# EAGLE design kbdctrl (EAGLE 7.5.0)
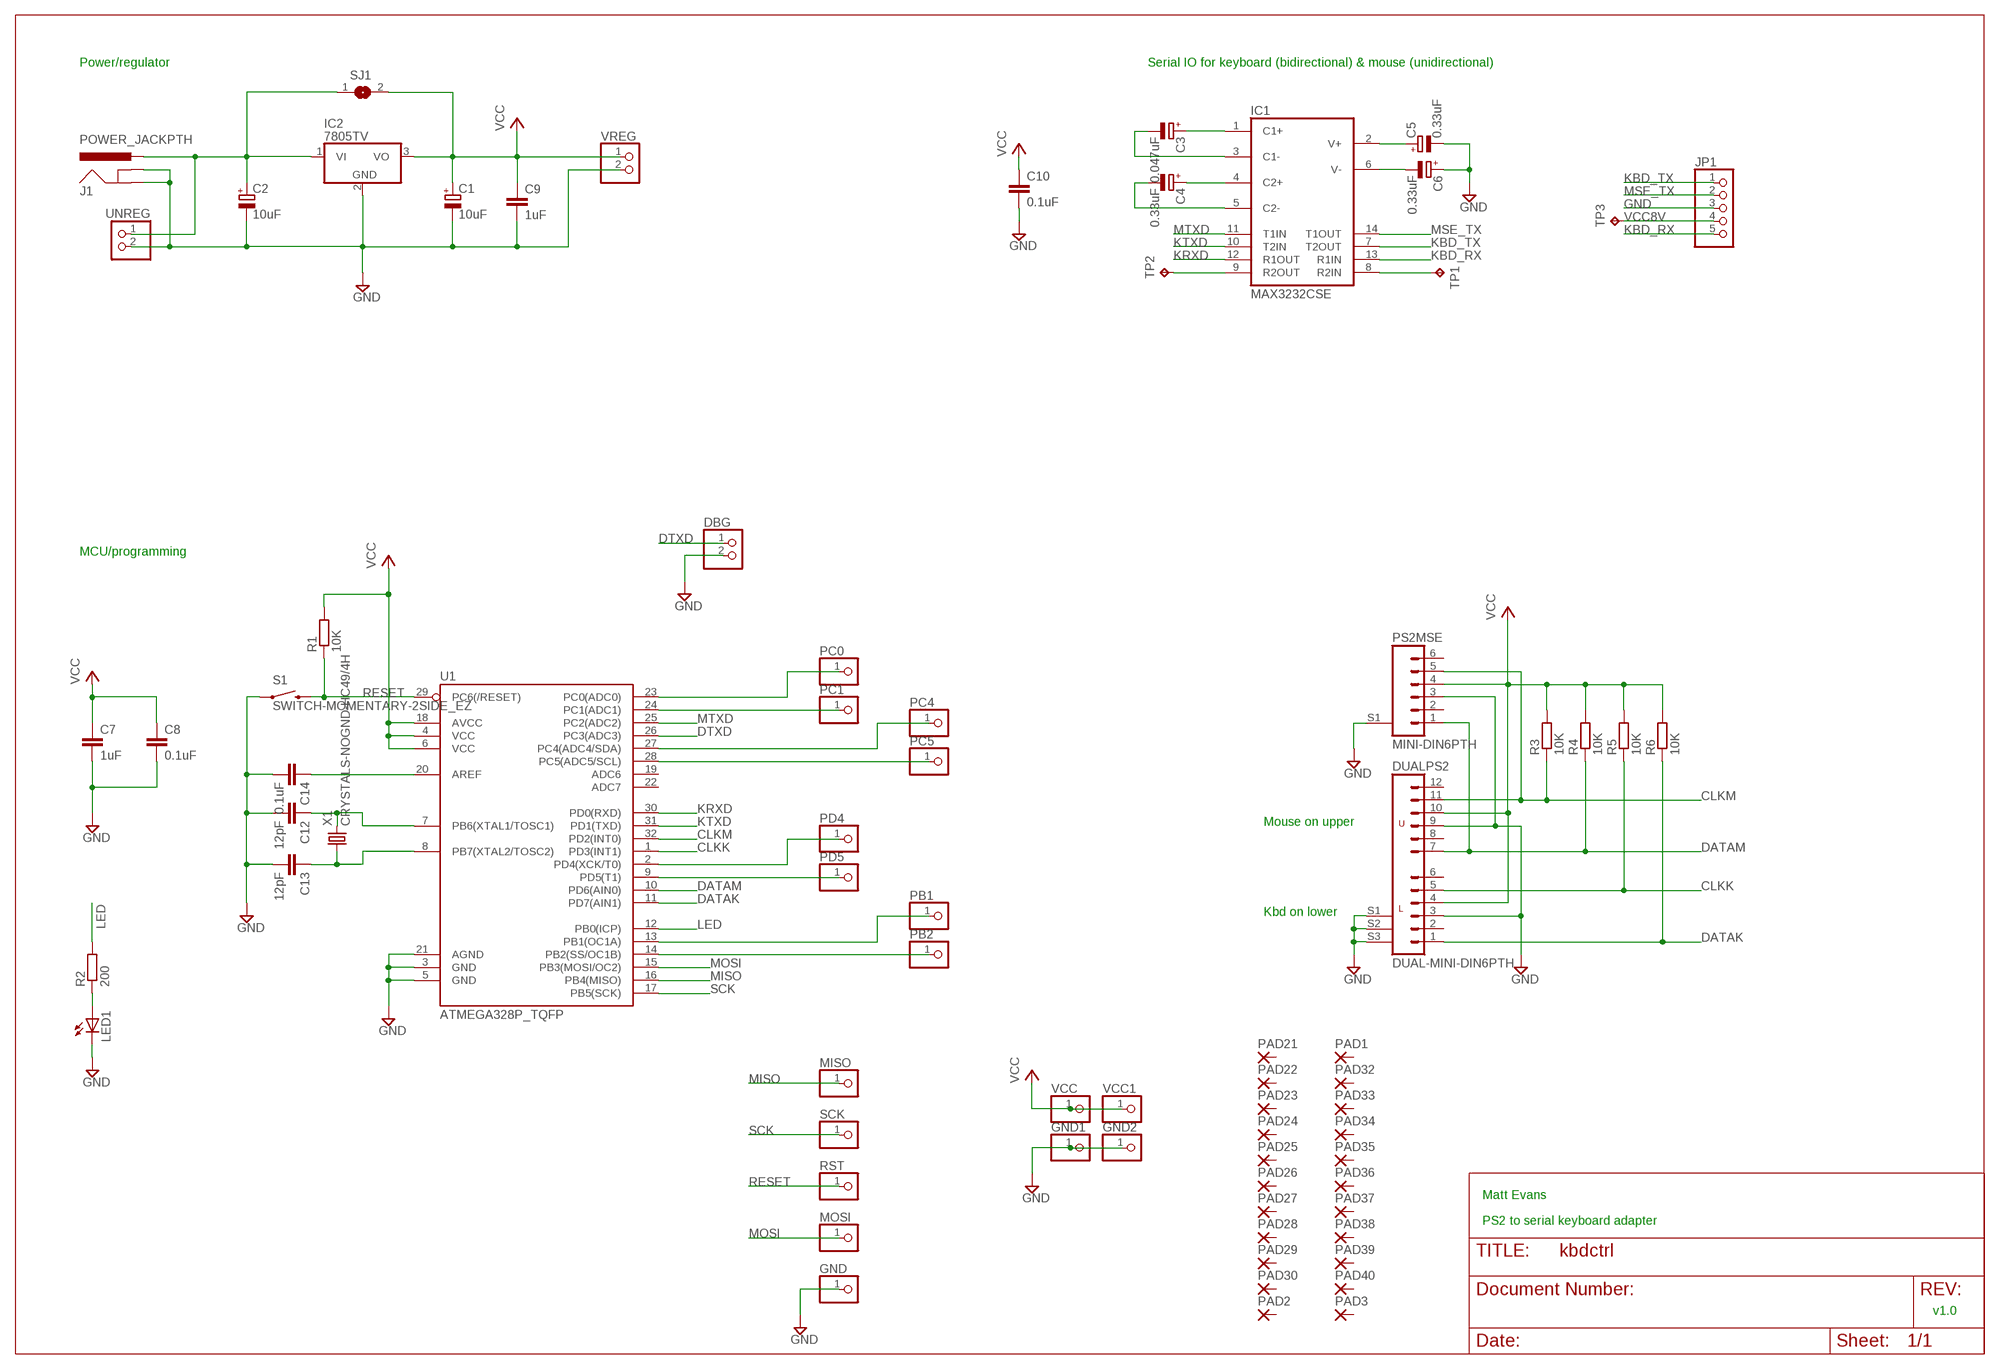
[diagram p0: schematic, sheet 1]

## Parts
C1  10uF  CPOL-EUSMCP  [SMC_P]
C2  10uF  CPOL-EUSMCP  [SMC_P]
C3  0.047uF  CPOL-EUSMCP  [SMC_P]
C4  0.33uF  CPOL-EUSMCP  [SMC_P]
C5  0.33uF  CPOL-EUSMCP  [SMC_P]
C6  0.33uF  CPOL-EUSMCP  [SMC_P]
C7  1uF  C-EUC0805  [C0805]
C8  0.1uF  C-EUC0805  [C0805]
C9  1uF  C-EUC0805  [C0805]
C10  0.1uF  C-EUC0805  [C0805]
C12  12pF  C-EUC0603  [C0603]
C13  12pF  C-EUC0603  [C0603]
C14  0.1uF  C-EUC0603  [C0603]
DBG  PINHD-1X2  [1X02]
DUALPS2  DUAL-MINI-DIN6PTH  [DUAL-MINI-DIN6]
GND  PINHD-1X1  [1X01]
GND1  PINHD-1X1  [1X01]
GND2  PINHD-1X1  [1X01]
IC1  MAX3232CSE  [SO16]
IC2  7805TV  [TO220V]
J1  POWER_JACKPTH  [POWER_JACK_PTH]
JP1  PINHD-1X5  [1X05]
LED1  LEDSML0805  [SML0805]
MISO  PINHD-1X1  [1X01]
MOSI  PINHD-1X1  [1X01]
PAD1  1,6/0,9  [1,6/0,9]
PAD2  1,6/0,9  [1,6/0,9]
PAD3  1,6/0,9  [1,6/0,9]
PAD21  1,6/0,9  [1,6/0,9]
PAD22  1,6/0,9  [1,6/0,9]
PAD23  1,6/0,9  [1,6/0,9]
PAD24  1,6/0,9  [1,6/0,9]
PAD25  1,6/0,9  [1,6/0,9]
PAD26  1,6/0,9  [1,6/0,9]
PAD27  1,6/0,9  [1,6/0,9]
PAD28  1,6/0,9  [1,6/0,9]
PAD29  1,6/0,9  [1,6/0,9]
PAD30  1,6/0,9  [1,6/0,9]
PAD32  1,6/0,9  [1,6/0,9]
PAD33  1,6/0,9  [1,6/0,9]
PAD34  1,6/0,9  [1,6/0,9]
PAD35  1,6/0,9  [1,6/0,9]
PAD36  1,6/0,9  [1,6/0,9]
PAD37  1,6/0,9  [1,6/0,9]
PAD38  1,6/0,9  [1,6/0,9]
PAD39  1,6/0,9  [1,6/0,9]
PAD40  1,6/0,9  [1,6/0,9]
PB1  PINHD-1X1  [1X01]
PB2  PINHD-1X1  [1X01]
PC0  PINHD-1X1  [1X01]
PC1  PINHD-1X1  [1X01]
PC4  PINHD-1X1  [1X01]
PC5  PINHD-1X1  [1X01]
PD4  PINHD-1X1  [1X01]
PD5  PINHD-1X1  [1X01]
PS2MSE  MINI-DIN6PTH  [MINI-DIN6]
R1  10K  R-EU_R0603  [R0603]
R2  200  R-EU_R0603  [R0603]
R3  10K  R-EU_R0603  [R0603]
R4  10K  R-EU_R0603  [R0603]
R5  10K  R-EU_R0603  [R0603]
R6  10K  R-EU_R0603  [R0603]
RST  PINHD-1X1  [1X01]
S1  SWITCH-MOMENTARY-2SIDE_EZ  [TACTILE-PTH-SIDEEZ]
SCK  PINHD-1X1  [1X01]
SJ1  SJ  [SJ]
TP1  TPTP09SQ  [TP09SQ]
TP2  TPTP09SQ  [TP09SQ]
TP3  TPTP09SQ  [TP09SQ]
U1  ATMEGA328P_TQFP  [TQFP32-08]
UNREG  PINHD-1X2  [1X02]
VCC  PINHD-1X1  [1X01]
VCC1  PINHD-1X1  [1X01]
VREG  PINHD-1X2  [1X02]
X1  CRYSTALS-NOGND-HC49/4H  [HC49]

## Nets
CLKK: DUALPS2.5 R5.1 U1.1(PD3(INT1))
CLKM: DUALPS2.11 PS2MSE.5 R3.1 U1.32(PD2(INT0))
DATAK: DUALPS2.1 R6.1 U1.11(PD7(AIN1))
DATAM: DUALPS2.7 PS2MSE.1 R4.1 U1.10(PD6(AIN0))
DTXD: DBG.1 U1.26(PC3(ADC3))
GND: C1.- C2.- C5.- C6.+ C7.2 C8.2 C9.2 C10.2 C12.2 C13.2 C14.2 DBG.2 DUALPS2.3 DUALPS2.9 DUALPS2.S1 DUALPS2.S2 DUALPS2.S3 GND1.1 GND2.1 GND.1 IC2.2(GND) J1.GND J1.GNDBREAK JP1.3 LED1.C PS2MSE.3 PS2MSE.S1 S1.1 U1.3(GND) U1.5(GND) U1.21(AGND) UNREG.2 VREG.2
KBD_RX: IC1.13(R1IN) JP1.5
KBD_TX: IC1.7(T2OUT) JP1.1
KRXD: IC1.12(R1OUT) U1.30(PD0(RXD))
KTXD: IC1.10(T2IN) U1.31(PD1(TXD))
LED: R2.2 U1.12(PB0(ICP))
MISO: MISO.1 U1.16(PB4(MISO))
MOSI: MOSI.1 U1.15(PB3(MOSI/OC2))
MSE_TX: IC1.14(T1OUT) JP1.2
MTXD: IC1.11(T1IN) U1.25(PC2(ADC2))
N$1: C3.- IC1.3(C1-)
N$2: C4.+ IC1.4(C2+)
N$3: C12.1 U1.7(PB6(XTAL1/TOSC1)) X1.2
N$4: C13.1 U1.8(PB7(XTAL2/TOSC2)) X1.1
N$5: C4.- IC1.5(C2-)
N$6: C2.+ IC2.1(VI) J1.PWR SJ1.1 UNREG.1
N$7: C14.1 U1.20(AREF)
N$8: C3.+ IC1.1(C1+)
N$9: C5.+ IC1.2(V+)
N$10: C6.- IC1.6(V-)
N$11: IC1.9(R2OUT) TP2.TP
N$12: IC1.8(R2IN) TP1.TP
N$13: LED1.A R2.1
N$15: PB1.1 U1.13(PB1(OC1A))
N$16: PD5.1 U1.9(PD5(T1))
N$17: PD4.1 U1.2(PD4(XCK/T0))
N$18: PC5.1 U1.28(PC5(ADC5/SCL))
N$20: PC1.1 U1.24(PC1(ADC1))
N$21: PC0.1 U1.23(PC0(ADC0))
PB2: PB2.1 U1.14(PB2(SS/OC1B))
PC4: PC4.1 U1.27(PC4(ADC4/SDA))
RESET: R1.1 RST.1 S1.2 U1.29(PC6(/RESET))
SCK: SCK.1 U1.17(PB5(SCK))
VCC: C1.+ C7.1 C8.1 C9.1 C10.1 DUALPS2.4 DUALPS2.10 IC2.3(VO) PS2MSE.4 R1.2 R3.2 R4.2 R5.2 R6.2 SJ1.2 U1.4(VCC) U1.6(VCC) U1.18(AVCC) VCC1.1 VCC.1 VREG.1
VCC8V: JP1.4 TP3.TP
Unconnected: DUALPS2.2 DUALPS2.6 DUALPS2.8 DUALPS2.12 PAD1.1(P) PAD2.1(P) PAD3.1(P) PAD21.1(P) PAD22.1(P) PAD23.1(P) PAD24.1(P) PAD25.1(P) PAD26.1(P) PAD27.1(P) PAD28.1(P) PAD29.1(P) PAD30.1(P) PAD32.1(P) PAD33.1(P) PAD34.1(P) PAD35.1(P) PAD36.1(P) PAD37.1(P) PAD38.1(P) PAD39.1(P) PAD40.1(P) PS2MSE.2 PS2MSE.6 U1.19(ADC6) U1.22(ADC7)

## Notes on the sheet
- Power/regulator | Serial IO for keyboard (bidirectional) & mouse (unidirectional)
- MCU/programming
- Mouse on upper
- Kbd on lower
- Matt Evans
- PS2 to serial keyboard adapter
- v1.0

## Power pins joined to a net without a drawn wire
GND: IC1.15(GND)
VCC: IC1.16(VCC)

## Library data of the parts
C1-C6 = resistor:CPOL-EU: POLARIZED CAPACITOR, European symbol
C7-C10 = resistor:C-EU: CAPACITOR, European symbol
C12-C14 = rcl:C-EU: CAPACITOR, European symbol
DBG UNREG VREG = matt:PINHD-1X2: PIN HEADER
DUALPS2 = matt:DUAL-MINI-DIN6: DUAL mini DIN 6 Connector Commonly found on the back of a computer for PS2 keyboard and mice. Derived from: Spark Fun Electronics SKU : PRT-08509
GND GND1 GND2 MISO MOSI PB1 PB2 PC0 PC1 PC4 PC5 PD4 PD5 RST SCK VCC VCC1 = pinhead:PINHD-1X1: PIN HEADER
IC1 = maxim:MAX3232*: True RS-232 Transceivers 3.0V to 5.5V, Low-Power up to 1Mbps, Using Four 0.1µF External Capacitors Source: http://pdfserv.maxim-ic.com/en/ds/MAX3222-MAX3241.pdf; MPN: MAX3232CSE; OC_FARNELL: 9725490; OC_NEWARK: 90C2890
IC2 = linear:78*: Positive VOLTAGE REGULATOR Source: http://cache.national.com/ds/LM/LM78L05.pdf http://www.fairchildsemi.com/ds/LM/LM7805.pdf
J1 = SparkFun-Connectors:POWER_JACK: Power Jack This is the standard 5.5mm barrel jack for power. The PTH is the most common, proven, reliable, footprint. The Slot footprint only works if the mill layer is transmitted to the PCB fab house so be warned. Mating wall wart : TOL-00298 (and others); PROD_ID: CONN-08197
JP1 = matt:PINHD-1X5: PIN HEADER
LED1 = led:LED: LED OSRAM: - CHIPLED LG R971, LG N971, LY N971, LG Q971, LY Q971, LO R971, LY R971 LH N974, LH R974 LS Q976, LO Q976, LY Q976 LO Q996 - Hyper CHIPLED LW Q18S LB Q993, LB Q99A, LB R99A - SideLED LS A670, LO A670, LY A670, LG A670, LP A670 LB A673, LV A673, LT A673, LW A673 LH A674 LY A675 LS A676, LA A676, LO A676, LY A676, LW A676 LS A679, LY A679, LG A679 - Hyper Micro SIDELED® LS Y876, LA Y876, LO Y876, LY Y876 LT Y87S - SmartLED LW L88C, LW L88S LB L89C, LB L89S, LG L890 LS L89K, LO L89K, LY L89K LS L896, LA L896, LO L896, LY L896 - TOPLED LS T670, LO T670, LY T670, LG T670, LP T670 LSG T670, LSP T670, LSY T670, LOP T670, LYG T670 LG T671, LOG T671, LSG T671 LB T673, LV T673, LT T673, LW T673 LH T674 LS T676, LA T676, LO T676, LY T676, LB T676, LH T676, LSB T676, LW T676 LB T67C, LV T67C, LT T67C, LS T67K, LO T67K, LY T67K, LW E67C LS E67B, LA E67B, LO E67B, LY E67B, LB E67C, LV E67C, LT E67C LW T67C LS T679, LY T679, LG T679 LS T770, LO T770, LY T770, LG T770, LP T770 LB T773, LV T773, LT T773, LW T773 LH T774 LS E675, LA E675, LY E675, LS T675 LS T776, LA T776, LO T776, LY T776, LB T776 LHGB T686 LT T68C, LB T68C - Hyper Mini TOPLED® LB M676 - Mini TOPLED Santana® LG M470 LS M47K, LO M47K, LY M47K Source: http://www.osram.convergy.de LUXEON: - LUMILED® LXK2-PW12-R00, LXK2-PW12-S00, LXK2-PW14-U00, LXK2-PW14-V00 LXK2-PM12-R00, LXK2-PM12-S00, LXK2-PM14-U00 LXK2-PE12-Q00, LXK2-PE12-R00, LXK2-PE12-S00, LXK2-PE14-T00, LXK2-PE14-U00 LXK2-PB12-K00, LXK2-PB12-L00, LXK2-PB12-M00, LXK2-PB14-N00, LXK2-PB14-P00, LXK2-PB14-Q00 LXK2-PR12-L00, LXK2-PR12-M00, LXK2-PR14-Q00, LXK2-PR14-R00 LXK2-PD12-Q00, LXK2-PD12-R00, LXK2-PD12-S00 LXK2-PH12-R00, LXK2-PH12-S00 LXK2-PL12-P00, LXK2-PL12-Q00, LXK2-PL12-R00 Source: www.luxeon.com KINGBRIGHT: KA-3528ASYC Source: www.kingbright.com
PAD1-PAD3 PAD21-PAD30 PAD32-PAD40 = wirepad:1,6/0,9: THROUGH-HOLE PAD
PS2MSE = matt:MINI-DIN6: mini DIN 6 Connector Commonly found on the back of a computer for PS2 keyboard and mice. Schematic and footprint are proven. Spark Fun Electronics SKU : PRT-08509
R1-R6 = rcl:R-EU_: RESISTOR, European symbol
S1 = SparkFun-Electromechanical:SWITCH-MOMENTARY-2: Various NO switches- pushbuttons, reed, etc
SJ1 = jumper:SJ: SMD solder JUMPER
TP1-TP3 = testpad:TP: Test pad
U1 = SparkFun-DigitalIC:ATMEGA328P_TQFP; PROD_ID: IC-09069
X1 = IQD-Frequency-Products:CRYSTALS-NOGND: CRYSTALS CAN NOT GROUNDED

## Board
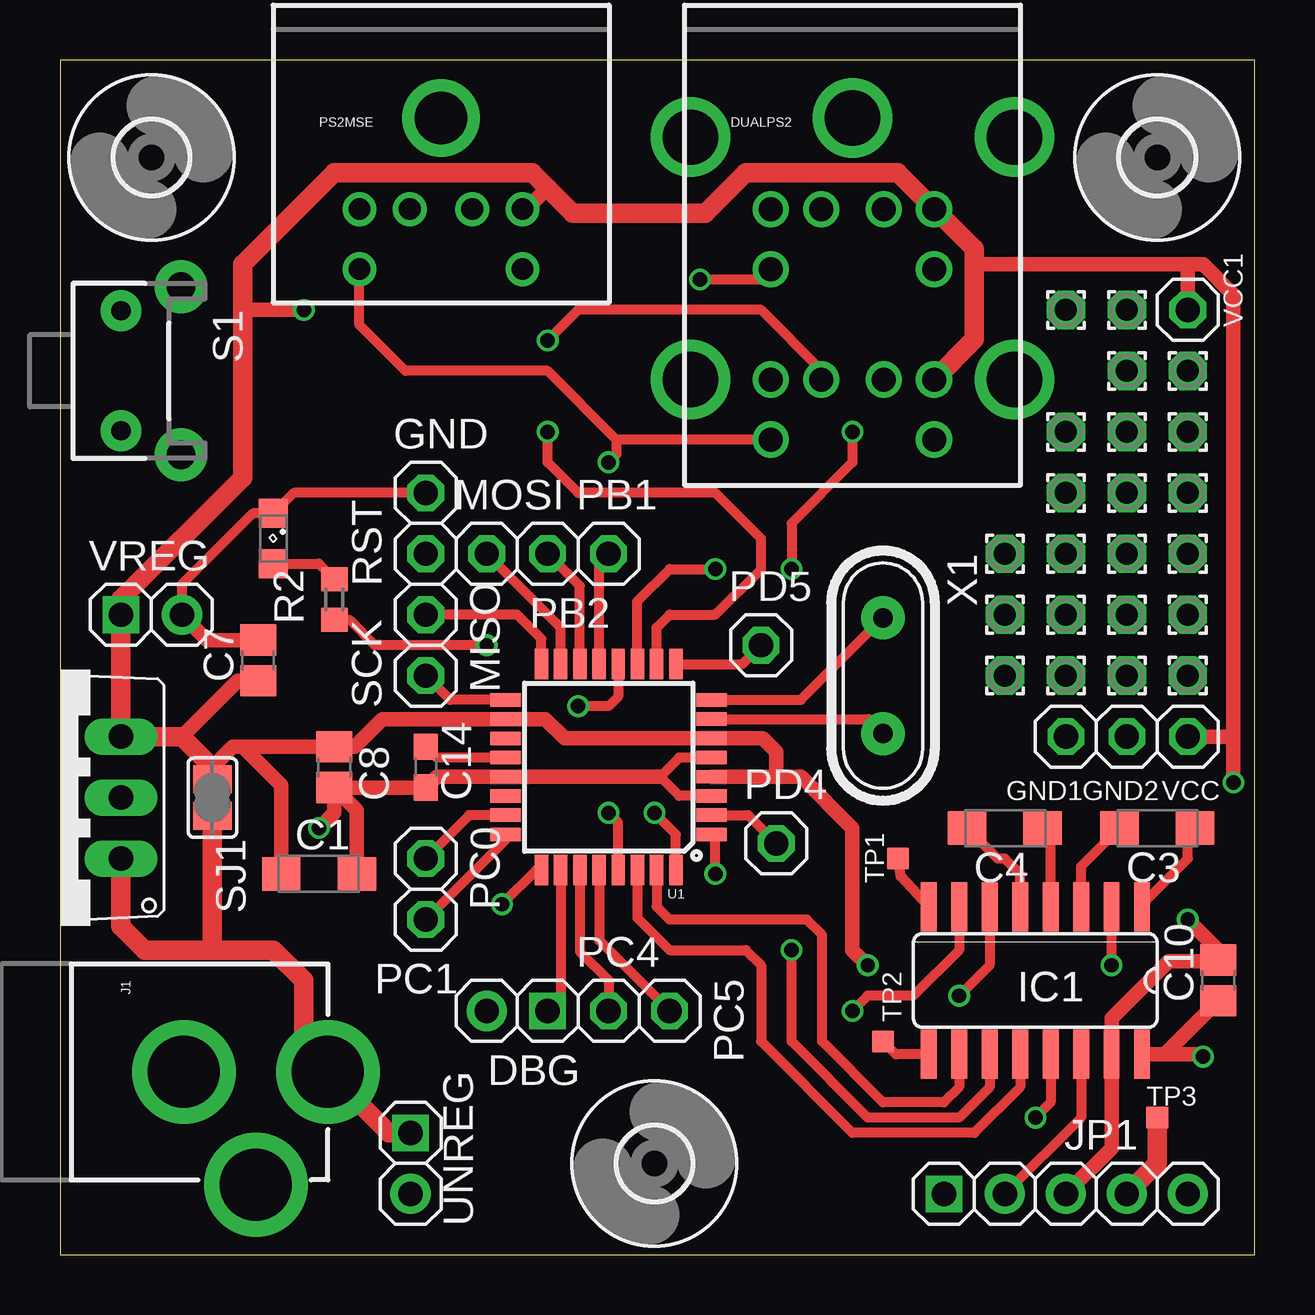
[diagram p1: board, top side]
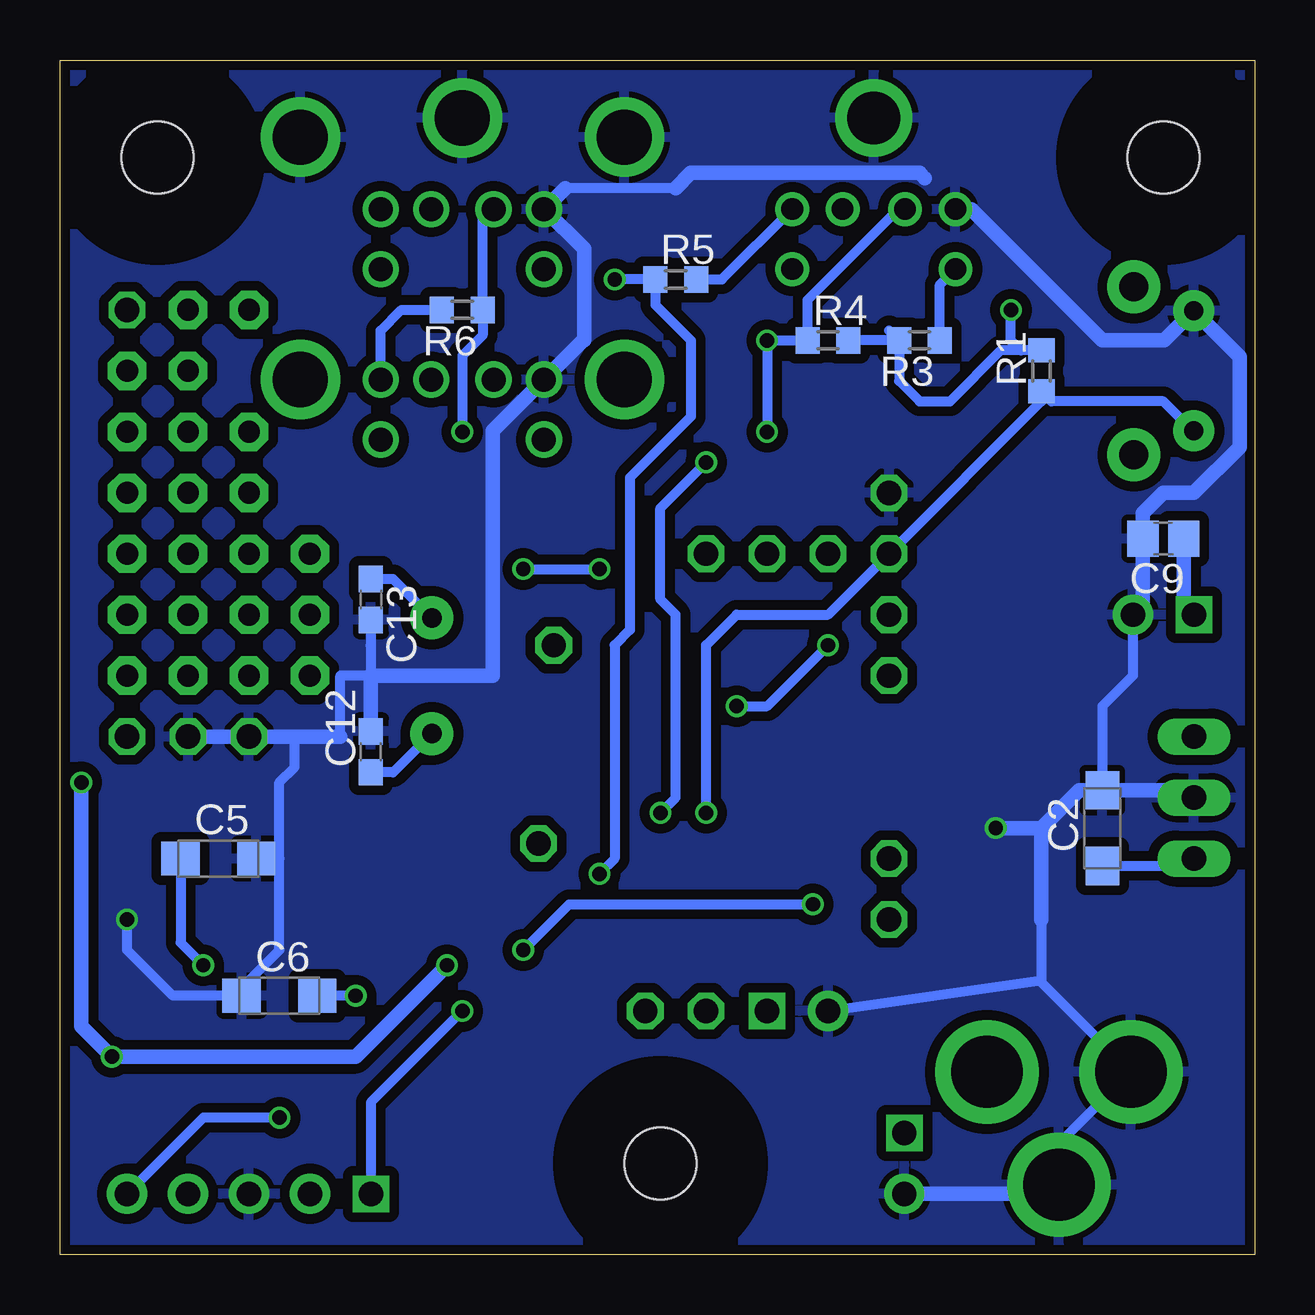
[diagram p2: board, bottom side, seen from below]

Size 49.78 x 49.78 mm. Coordinates in mm from the lower left corner, seen from the top.
Outline: 0,0 49.78,0 49.78,49.78 0,49.78 0,0
Copper layers (1*16): Top 0.035mm / dielectric 1.5mm / Bottom 0.035mm
Design rules "SeeedStudio_2layer_DRU_no_angle_20140221": minimum track width 6mil, minimum drill 12mil, track to track 6mil, track to pad 6mil, pad to pad 6mil, via to via 6mil, smd to smd 0mil, copper to edge 10mil, drill to drill 10mil, minimum pad ring 10mil, minimum via ring 6mil, stop-mask expansion 2mil, vias tented up to drill 100mil, thermal gap 10mil

### Footprints (pad centres in the part's own frame; a part is rotated, then mirrored left to right if it is on the bottom)
SMC_P = smd 1.6 x 1.4: + -1.575,0; - 1.575,0
C0805 = smd 1.3 x 1.5: 1 -0.85,0; 2 0.85,0
C0603 = smd 1.1 x 1: 1 -0.85,0; 2 0.85,0
1X02 = drill 1.016 square: 1 -1.27,0 | drill 1.016 pad 1.676: 2 1.27,0
DUAL-MINI-DIN6 = drill 1: 1 -1.3,-8.5; 2 1.3,-8.5; 3 -3.4,-8.5; 4 3.4,-8.5; 5 -3.4,-11; 6 3.4,-11; 7 -1.3,-15.6; 8 1.3,-15.6; 9 -3.4,-15.6; 10 3.4,-15.6; 11 -3.4,-18.1; 12 3.4,-18.1 | drill 2.3: S1 0,-4.7; S2 -6.75,-5.5; S3 6.75,-5.5; S4 -6.75,-15.6; S5 6.75,-15.6
1X01 = drill 1.016 octagon: 1 0,0
SO16 = smd 0.66 x 2.032: 1 -4.445,-3.073; 2 -3.175,-3.073; 3 -1.905,-3.073; 4 -0.635,-3.073; 5 0.635,-3.073; 6 1.905,-3.073; 7 3.175,-3.073; 8 4.445,-3.073; 9 4.445,3.073; 10 3.175,3.073; 11 1.905,3.073; 12 0.635,3.073; 13 -0.635,3.073; 14 -1.905,3.073; 15 -3.175,3.073; 16 -4.445,3.073
TO220V = drill 1.016 long: 1 -2.54,-2.54; 2 0,-2.54; 3 2.54,-2.54
POWER_JACK_PTH = drill 2.997 pad 4.318: GND 0,7.7; GNDBREAK 4.7,10.7; PWR 0,13.7
1X05 = drill 1.016 square: 1 -5.08,0 | drill 1.016 pad 1.676: 2 -2.54,0; 3 0,0; 4 2.54,0; 5 5.08,0
SML0805 = smd 1.2 x 1.2: A 1.05,0; C -1.05,0
1,6/0,9 = drill 0.914 pad 1.6 octagon: 1 0,0
MINI-DIN6 = drill 0.9: 1 -1.3,-8.5; 2 1.3,-8.5; 3 -3.4,-8.5; 4 3.4,-8.5; 5 -3.4,-11; 6 3.4,-11 | drill 2.2: S1 0,-4.7
R0603 = smd 1 x 1.1: 1 -0.85,0; 2 0.85,0
TACTILE-PTH-SIDEEZ = drill 0.8 pad 1.7: 1 -2.5,0; 2 2.5,0 | drill 1.2 pad 2.2: ANCHOR1 -3.5,2.5; ANCHOR2 3.5,2.5
SJ = smd 1.168 x 1.6: 1 -0.762,0; 2 0.762,0
TP09SQ = smd 0.9 x 0.9: TP 0,0
TQFP32-08 = smd 1.27 x 0.559: 1 -4.293,2.8; 2 -4.293,2; 3 -4.293,1.2; 4 -4.293,0.4; 5 -4.293,-0.4; 6 -4.293,-1.2; 7 -4.293,-2; 8 -4.293,-2.8; 17 4.293,-2.8; 18 4.293,-2; 19 4.293,-1.2; 20 4.293,-0.4; 21 4.293,0.4; 22 4.293,1.2; 23 4.293,2; 24 4.293,2.8 | smd 0.559 x 1.27: 9 -2.8,-4.293; 10 -2,-4.293; 11 -1.2,-4.293; 12 -0.4,-4.293; 13 0.4,-4.293; 14 1.2,-4.293; 15 2,-4.293; 16 2.8,-4.293; 25 2.8,4.293; 26 2,4.293; 27 1.2,4.293; 28 0.4,4.293; 29 -0.4,4.293; 30 -1.2,4.293; 31 -2,4.293; 32 -2.8,4.293
3,0 = hole 3: 0,0
HC49 = drill 0.813 pad 1.8: 1 -2.413,0; 2 2.413,0

### Placement (x,y rotation side)
C1  10.79,15.88 0 top
C2  6.35,17.78 90 bottom
C3  45.72,17.78 180 top
C4  39.37,17.78 180 top
C5  43.18,16.51 0 bottom
C6  40.64,10.79 0 bottom
C7  8.26,24.77 90 top
C8  11.43,20.32 270 top
C9  3.81,29.84 180 bottom
C10  48.26,11.43 90 top
C12  36.83,20.95 90 bottom
C13  36.83,27.3 270 bottom
C14  15.24,20.32 270 top
DBG  19.05,10.16 180 top
DUALPS2  33.02,52.07 0 top
GND  15.24,31.75 0 top
GND1  41.91,21.59 180 top
GND2  44.45,21.59 180 top
IC1  40.64,11.43 180 top
IC2  0,19.05 90 top
J1  -2.54,7.62 270 top
JP1  41.91,2.54 0 top
LED1  8.89,29.84 270 top
MISO  15.24,26.67 270 top
MOSI  17.78,29.21 0 top
PAD1  39.37,29.21 0 top
PAD2  39.37,26.67 0 top
PAD3  39.37,24.13 0 top
PAD21  44.45,36.83 0 top
PAD22  46.99,36.83 0 top
PAD23  44.45,34.29 0 top
PAD24  46.99,34.29 0 top
PAD25  44.45,31.75 0 top
PAD26  46.99,31.75 0 top
PAD27  44.45,29.21 0 top
PAD28  46.99,29.21 0 top
PAD29  44.45,26.67 0 top
PAD30  46.99,26.67 0 top
PAD32  41.91,26.67 0 top
PAD33  41.91,29.21 0 top
PAD34  41.91,31.75 0 top
PAD35  41.91,34.29 0 top
PAD36  44.45,24.13 0 top
PAD37  46.99,24.13 0 top
PAD38  41.91,24.13 0 top
PAD39  41.91,39.37 0 top
PAD40  44.45,39.37 0 top
PB1  22.86,29.21 0 top
PB2  20.32,29.21 180 top
PC0  15.24,16.51 270 top
PC1  15.24,13.97 180 top
PC4  22.86,10.16 0 top
PC5  25.4,10.16 270 top
PD4  29.84,17.14 0 top
PD5  29.21,25.4 0 top
PS2MSE  15.88,52.07 0 top
R1  8.89,36.83 90 bottom
R2  11.43,27.3 270 top
R3  13.97,38.1 180 bottom
R4  17.78,38.1 0 bottom
R5  24.13,40.64 0 bottom
R6  33.02,39.37 180 bottom
RST  15.24,29.21 90 top
S1  2.54,36.83 270 top
SCK  15.24,24.13 90 top
SJ1  6.35,19.05 90 top
TP1  34.92,16.51 180 top
TP2  34.29,8.89 180 top
TP3  45.72,5.71 0 top
U1  22.86,20.32 180 top
U$2  [3,0]  3.81,45.72 0 top
U$3  [3,0]  45.72,45.72 0 top
U$4  [3,0]  24.77,3.81 0 top
UNREG  14.61,3.81 270 top
VCC  46.99,21.59 180 top
VCC1  46.99,39.37 0 top
VREG  3.81,26.67 0 top
X1  34.29,24.13 270 top

### Tracks (layer width: path | path; a pad name or v marks a point on that pad's centre or on a via)
CLKK  (via drill 0.6)
  Top 0.406: v26.67,40.64 29.19,40.64 DUALPS2.5 | v27.3,15.88 27.3,17.37 U1.1
  Bottom 0.406: v26.67,40.64 R5.1 24.98,39.59 23.5,38.1 23.5,34.92 26.04,32.38 26.04,26.04 26.67,25.4 26.67,16.51 v27.3,15.88
CLKM  (via drill 0.6)
  Top 0.406: DUALPS2.11 23.18,33.97 | 23.18,33.97 20.32,36.83 14.39,36.83 12.47,38.74 PS2MSE.5 | 23.18,33.97 23.18,33.34 v22.86,33.02 | U1.32 25.66,17.52 v24.77,18.41
  Bottom 0.406: R3.1 13.12,40.42 PS2MSE.5 | v24.77,18.41 24.13,19.05 24.13,26.67 24.77,27.3 24.77,31.11 v22.86,33.02
DATAK  (via drill 0.6)
  Top 0.406: U1.11 24.06,27.23 25.4,28.57 v27.3,28.57 | v33.02,34.29 33.02,33.02 30.48,30.48 v30.48,28.57
  Bottom 0.406: DUALPS2.1 32.17,43.12 R6.1 32.17,38.31 33.02,37.47 v33.02,34.29 | v30.48,28.57 v27.3,28.57
DATAM  (via drill 0.6)
  Top 0.406: DUALPS2.7 31.72,36.86 29.21,39.37 21.59,39.37 v20.32,38.1 | U1.10 24.86,26.13 25.4,26.67 27.3,26.67 29.21,28.57 29.21,29.84 27.3,31.75 21.59,31.75 20.32,33.02 v20.32,34.29
  Bottom 0.406: v20.32,34.29 v20.32,38.1 R4.1 18.63,39.79 14.85,43.57 PS2MSE.1
DTXD
  Top 0.406: U1.26 20.86,10.7 DBG.1
GND  (via drill 0.6)
  Top 0.406: 48.21,12.23 C10.2 | GND.1 9.74,31.75 LED1.C 8.04,30.89 5.08,27.94 VREG.2 | U1.5 25.8,20.72 25,19.92 25.8,19.12 U1.3
  Top 0.61: 48.21,12.23 46.19,12.23 43.81,9.86 IC1.15 43.81,4.45 JP1.3 | 25,19.92 U1.21 15.69,19.92 C14.2 C8.2 | C7.2 6.13,25.61 VREG.2 | C1.- 12.37,18.53 C8.2 | C8.2 11.43,18.41 v10.79,17.78 | C10.2 48.26,12.7 v46.99,13.97
  Bottom 0.406: 24.13,44.45 28.74,44.45 | DUALPS2.3 29.6,43.57 | 27.94,38.1 27.99,38.1 | C2.- 6.35,22.86 5.08,24.13 VREG.2 4.66,27.09 | 38.1,21.59 38.1,24.13 36.83,24.13 36.84,25.39 C13.2 | v46.99,13.97 46.99,12.7 45.09,10.79 C6.+ 42.22,11.12 40.64,12.7 40.64,16.51 | 40.64,16.51 40.64,19.68 40.01,20.32 40.01,21.59 | C5.- 40.64,16.51 | 8.89,13.97 8.89,11.43 | 8.89,11.43 8.89,11.35 J1.GND 8.16,4.62 J1.GNDBREAK 8.54,2.54 | DBG.2 8.89,11.43
  Bottom 0.61: 13.74,44.86 13.97,45.09 23.5,45.09 24.13,44.45 | 28.74,44.45 DUALPS2.3 | 29.6,43.57 27.94,41.91 27.94,38.1 | 27.99,38.1 DUALPS2.9 31.75,34.34 31.75,24.13 36.83,24.13 36.84,24.14 C12.2 | IC2.2 2.85,19.36 C2.- 7.32,19.36 8.89,17.78 | 8.89,17.78 8.89,13.97 | 4.66,27.09 C9.2 4.66,30.9 3.81,31.75 2.54,31.75 0.64,33.66 0.64,37.42 S1.1 3.77,38.1 6.35,38.1 11.82,43.57 | v10.79,17.78 8.89,17.78 | 38.1,21.59 40.01,21.59 GND1.1 GND2.1 | UNREG.2 8.54,2.54
  pour Bottom (isolate 0.406): 0,49.53 49.53,49.53 49.53,0 0,0
KBD_RX  (via drill 0.6)
  Top 0.406: IC1.13 41.27,6.35 v40.64,5.71
  Bottom 0.406: v40.64,5.71 43.81,5.71 JP1.5
KBD_TX  (via drill 0.6)
  Top 0.406: IC1.7 37.47,12.7 35.56,10.79 33.66,10.79 v33.02,10.16
  Bottom 0.406: v33.02,10.16 36.83,6.35 JP1.1
KRXD
  Top 0.406: IC1.12 40.01,6.99 38.1,5.08 33.02,5.08 29.21,8.89 29.21,12.06 28.57,12.7 25.4,12.7 24.06,14.04 U1.30
KTXD
  Top 0.406: IC1.10 37.47,6.99 36.83,6.35 34.29,6.35 31.75,8.89 31.75,13.34 31.11,13.97 25.4,13.97 24.86,14.51 U1.31
LED  (via drill 0.6)
  Top 0.406: 23.26,25 U1.12 23.26,23.26 22.86,22.86 v21.59,22.86 | v17.78,25.4 13.12,25.4 12.06,26.45 R2.2
  Bottom 0.406: v21.59,22.86 20.32,22.86 v17.78,25.4
MISO
  Top 0.406: U1.16 20.06,25.66 19.05,26.67 MISO.1
MOSI
  Top 0.406: U1.15 20.86,26.13 MOSI.1
MSE_TX
  Top 0.406: IC1.14 42.55,5.71 JP1.2
MTXD  (via drill 0.6)
  Top 0.406: IC1.11 38.73,6.99 37.47,5.71 33.66,5.71 30.48,8.89 v30.48,12.7 | U1.25 19.84,16.03 v18.41,14.61
  Bottom 0.406: v30.48,12.7 28.57,14.61 v18.41,14.61
N$1
  Top 0.406: IC1.3 42.55,16.18 C3.-
N$2
  Top 0.406: IC1.4 41.27,17.45 C4.+
N$3
  Top 0.406: U1.7 33.69,22.32 X1.2
  Bottom 0.406: X1.2 35.9,20.11 C12.1
N$4
  Top 0.406: U1.8 30.87,23.12 X1.1
  Bottom 0.406: X1.1 35.9,28.16 C13.1
N$5
  Top 0.406: IC1.5 40.01,15.88 39.37,16.51 39.06,16.51 C4.-
N$6
  Top 0.61: 10.16,8.62 J1.PWR
  Top 0.813: IC2.1 2.54,13.7 3.54,12.7 6.35,12.7 | UNREG.1 13.7,5.08 J1.PWR | SJ1.1 6.35,12.7 | 6.35,12.7 8.89,12.7 10.16,11.43 10.16,8.62
  Bottom 0.406: C2.+ 2.85,16.2 IC2.1
N$7
  Top 0.406: U1.20 15.69,20.72 C14.1
N$8
  Top 0.406: IC1.1 45.09,14.61 46.99,16.51 46.99,17.48 C3.+
N$9  (via drill 0.6)
  Top 0.406: v43.81,12.06 IC1.2
  Bottom 0.406: C5.+ 44.76,13.01 v43.81,12.06
N$10  (via drill 0.6)
  Top 0.406: IC1.6 38.73,12.06 v37.47,10.79
  Bottom 0.406: v37.47,10.79 C6.-
N$11
  Top 0.406: IC1.9 34.82,8.36 TP2.TP
N$12
  Top 0.406: IC1.8 35.03,15.77 TP1.TP
N$13
  Top 0.406: LED1.A 10.79,28.8 R2.1
N$15
  Top 0.406: U1.13 22.46,28.81 PB1.1
N$16
  Top 0.406: U1.9 28.42,24.61 PD5.1
N$17
  Top 0.406: U1.2 28.67,18.32 PD4.1
N$18
  Top 0.406: U1.28 22.46,13.1 PC5.1
N$20
  Top 0.406: U1.24 18.57,17.3 PC1.1
N$21
  Top 0.406: U1.23 17.05,18.32 PC0.1
PB2
  Top 0.406: U1.14 21.66,27.87 PB2.1
PC4
  Top 0.406: U1.27 21.66,12.63 22.86,11.43 PC4.1
RESET  (via drill 0.6)
  Top 0.406: U1.29 23.26,18.02 v22.86,18.41
  Bottom 0.406: S1.2 2.58,34.33 3.81,35.56 8.47,35.56 R1.1 8.89,35.56 RST.1 17.78,26.67 21.59,26.67 22.86,25.4 v22.86,18.41
SCK
  Top 0.406: U1.17 16.25,23.12 SCK.1
VCC  (via drill 0.6)
  Top 0.406: SJ1.2 6.35,20.32 | IC1.16 46.04,8.36 | 47.52,8.36 v47.62,8.26 | C8.1 12.28,21.17 | DUALPS2.4 36.44,43.57 | 19.44,43.57 PS2MSE.4
  Top 0.61: 46.04,8.36 C10.1 | IC1.16 47.52,8.36 | v33.66,12.06 33.02,12.7 33.02,17.78 30.88,19.92 29.84,19.92 | U1.4 29.84,19.92 | 12.28,21.17 13.43,22.32 U1.18 20.23,22.32 21.02,21.52 U1.6 29.28,21.52 29.84,20.95 29.84,19.92 | 2.96,27.09 VREG.1 2.54,27.3 | C7.1 7.41,23.91 5.08,21.59 | C8.1 7.62,21.17 | 7.62,21.17 7.2,21.17 6.35,20.32 | C1.+ 9.22,19.57 7.62,21.17 | v10.16,39.37 7.62,39.37 | 38.1,41.27 46.99,41.27 | 46.99,41.27 47.62,41.27 48.9,40.01 48.9,21.59 | 48.9,21.59 v48.9,19.68 | VCC.1 48.9,21.59 | VCC1.1 46.99,41.27 | 20.32,44.45 19.91,44.04 19.44,43.57
  Top 0.813: DUALPS2.4 34.91,45.09 28.57,45.09 26.89,43.41 21.36,43.41 20.32,44.45 19.68,45.09 11.43,45.09 7.62,41.27 7.62,39.37 7.62,32.38 2.54,27.3 | 6.35,20.32 5.08,21.59 IC2.3 VREG.1 | 36.44,43.57 38.1,41.91 38.1,41.27 38.1,38.15 DUALPS2.10
  Bottom 0.406: R3.2 R4.2 | 15.24,38.52 R3.2 | R5.2 22.2,40.64 PS2MSE.4 | 2.96,27.09 VREG.1 | R3.2 14.82,36.41 13.97,35.56 12.7,35.56 10.58,37.68 R1.2 9.74,37.68 10.16,38.1 v10.16,39.37 | DUALPS2.10 36.42,38.51 35.56,39.37 R6.2
  Bottom 0.61: v33.66,12.06 37.47,8.26 v47.62,8.26 48.9,9.53 v48.9,19.68 | C9.1 2.96,27.09
VCC8V
  Top 0.813: JP1.4 45.72,3.81 TP3.TP

### Text on the board
tDocu: kbdctrl v1 | Matt Evans | 100516